# Altium schematic sheet Power.SchDoc
size A4; SheetNumber: 1; SheetTotal: 1
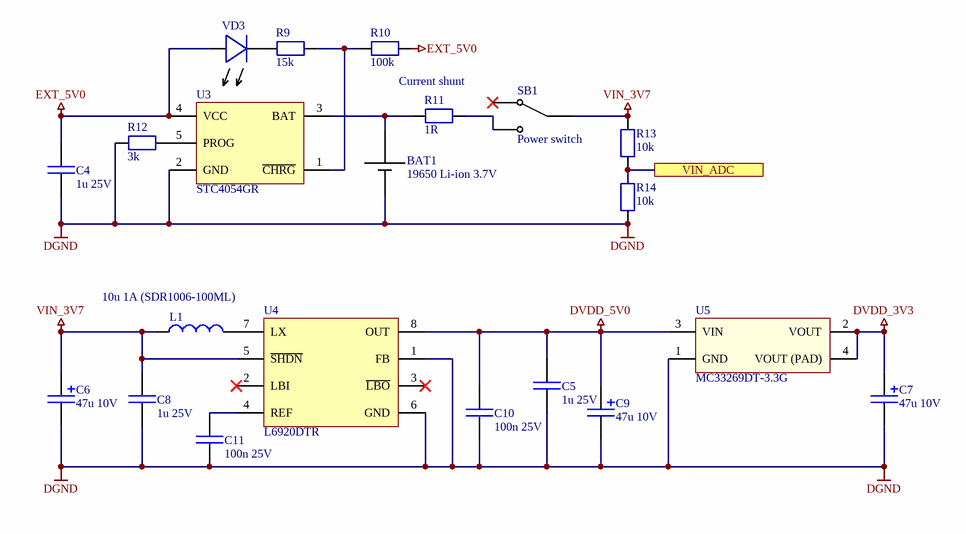
[diagram p0: Power.SchDoc]

## Parts
BAT1  19650 Li-ion 3.7V  [PLS-2 2.54]
C4  1u 25V  [C_0603/1608]
C5  1u 25V  [C_0603/1608]
C6  47u 10V  [TECAP_TYPE_B]
C7  47u 10V  [TECAP_TYPE_B]
C8  1u 25V  [C_0603/1608]
C9  47u 10V  [TECAP_TYPE_B]
C10  100n 25V  [C_0603/1608]
C11  100n 25V  [C_0603/1608]
L1  10u 1A (SDR1006-100ML)  [L_1006]
R9  15k  [R_0603/1608]
R10  100k  [R_0603/1608]
R11  1R  [R_0603/1608]
R12  3k  [R_0603/1608]
R13  10k  [R_0603/1608]
R14  10k  [R_0603/1608]
SB1  Power switch  [KBB40_2P2W]
U3  STC4054GR  [SOT23-5]
U4  L6920DTR  [SO8_0.65]
U5  MC33269DT-3.3G  [TO252AA/DPAK]
VD3  (no value)  [PLS-2 2.54]

## Ports
VIN_ADC

## Nets
DGND: BAT1.1 C4.2 C5.2 C6.2(NEG) C7.2(NEG) C8.2 C9.2(NEG) C10.2 C11.2 R12.2 R14.1 U3.2(GND) U4.1(FB) U4.6(GND) U5.1(GND)
DVDD_3V3: C7.1(POS) U5.2(VOUT) U5.4(VOUT_(PAD))
DVDD_5V0: C5.1 C9.1(POS) C10.1 U4.8(OUT) U5.3(VIN)
EXT_5V0: C4.1 R10.2 U3.4(VCC) VD3.A
VIN_3V7: C6.1(POS) C8.1 L1.1 R13.2 SB1.1 U4.5(~{SHDN})
VIN_ADC: R13.1 R14.2 ; port VIN_ADC
NetBAT1_2: BAT1.2 R11.2 U3.3(BAT)
NetC11_1: C11.1 U4.4(REF)
NetL1_2: L1.2 U4.7(LX)
NetR9_1: R9.1 R10.1 U3.1(~{CHRG})
NetR9_2: R9.2 VD3.C
NetR11_1: R11.1 SB1.3
NetR12_1: R12.1 U3.5(PROG)

Not connected (* = marked no-connect by the designer): SB1 2*; U4 2(LBI)* 3(~{LBO})*

## Notes on the sheet
- Current shunt

## Library data of the parts
BAT1 = Battery
C4 C5 C8 C10 C11 = Capacitor: Non-polarized capacitor
C6 C7 C9 = Capacitor polar: Polarized capacitor
L1 = Inductor
R9-R14 = Resistor
SB1 = Switch 3-pin
U3 = STC4054GR: Li-ion charger
U4 = L6920DTR: DC-DC step-up switching regulator
U5 = LM1117: LDO voltage regulator; pin to pad: 2>3 3>2 4>3
VD3 = LED: pin to pad: A>1 C>2